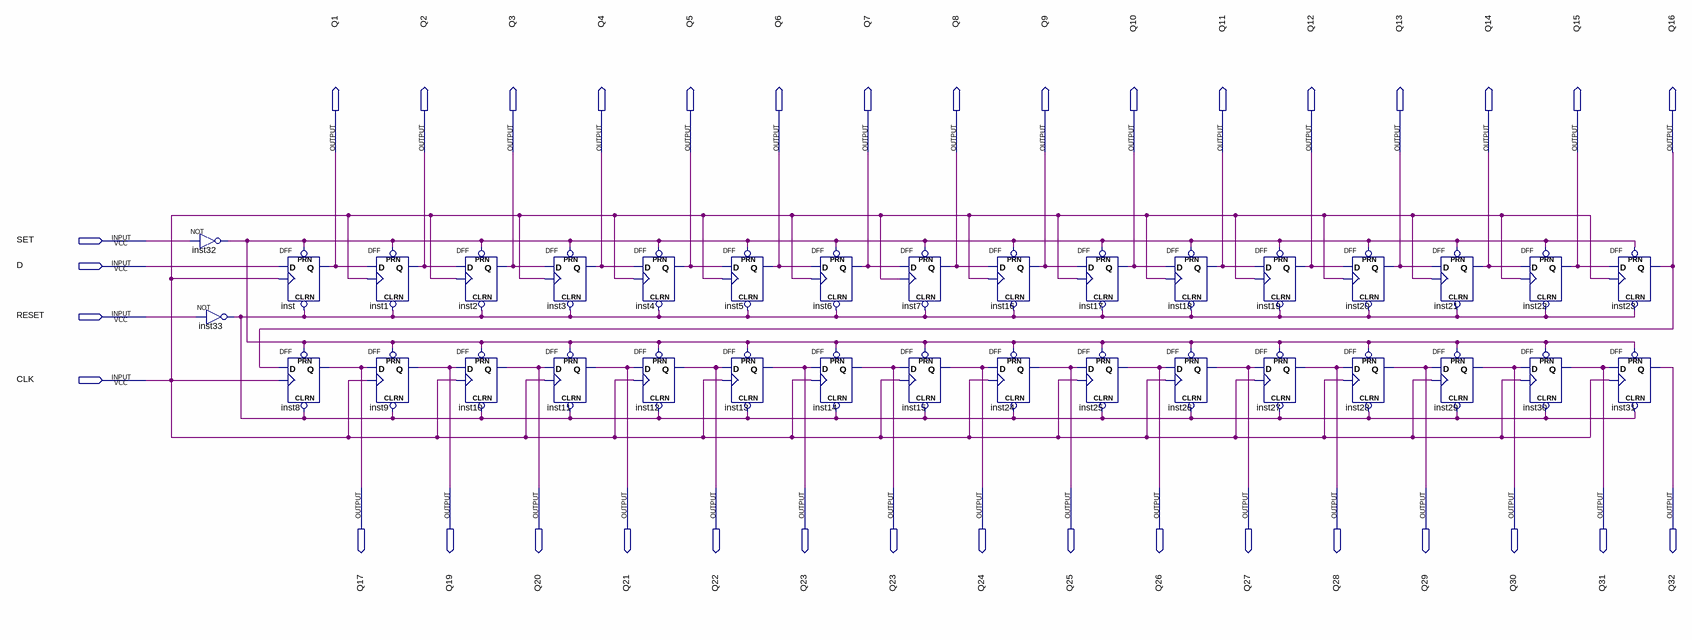
[diagram p0: schematic sheet]
// Quartus schematic registrador_32bits.bdf as structural Verilog: 34 symbols, 36 pins
module registrador_32bits (
  input  SET,
  input  D,
  input  RESET,
  input  CLK,
  output Q1,
  output Q2,
  output Q3,
  output Q4,
  output Q5,
  output Q6,
  output Q7,
  output Q8,
  output Q9,
  output Q10,
  output Q11,
  output Q12,
  output Q13,
  output Q14,
  output Q15,
  output Q16,
  output Q17,
  output Q19,
  output Q20,
  output Q21,
  output Q22,
  output Q23,
  output Q24,
  output Q25,
  output Q26,
  output Q27,
  output Q28,
  output Q29,
  output Q30,
  output Q31,
  output Q32
);

  wire inst32_out, inst33_out;

  not inst32 (inst32_out, SET);
  not inst33 (inst33_out, RESET);
  DFF inst (.CLRN(inst33_out), .CLK(CLK), .D(D), .PRN(inst32_out), .Q(Q1));
  DFF inst8 (.CLRN(inst33_out), .CLK(CLK), .D(Q16), .PRN(inst32_out), .Q(Q17));
  DFF inst1 (.CLRN(inst33_out), .CLK(CLK), .D(Q1), .PRN(inst32_out), .Q(Q2));
  DFF inst9 (.CLRN(inst33_out), .CLK(CLK), .D(Q17), .PRN(inst32_out), .Q(Q19));
  DFF inst2 (.CLRN(inst33_out), .CLK(CLK), .D(Q2), .PRN(inst32_out), .Q(Q3));
  DFF inst10 (.CLRN(inst33_out), .CLK(CLK), .D(Q19), .PRN(inst32_out), .Q(Q20));
  DFF inst3 (.CLRN(inst33_out), .CLK(CLK), .D(Q3), .PRN(inst32_out), .Q(Q4));
  DFF inst11 (.CLRN(inst33_out), .CLK(CLK), .D(Q20), .PRN(inst32_out), .Q(Q21));
  DFF inst4 (.CLRN(inst33_out), .CLK(CLK), .D(Q4), .PRN(inst32_out), .Q(Q5));
  DFF inst12 (.CLRN(inst33_out), .CLK(CLK), .D(Q21), .PRN(inst32_out), .Q(Q22));
  DFF inst5 (.CLRN(inst33_out), .CLK(CLK), .D(Q5), .PRN(inst32_out), .Q(Q6));
  DFF inst13 (.CLRN(inst33_out), .CLK(CLK), .D(Q22), .PRN(inst32_out), .Q(Q23));
  DFF inst6 (.CLRN(inst33_out), .CLK(CLK), .D(Q6), .PRN(inst32_out), .Q(Q7));
  DFF inst14 (.CLRN(inst33_out), .CLK(CLK), .D(Q23), .PRN(inst32_out), .Q(Q23));
  DFF inst7 (.CLRN(inst33_out), .CLK(CLK), .D(Q7), .PRN(inst32_out), .Q(Q8));
  DFF inst15 (.CLRN(inst33_out), .CLK(CLK), .D(Q23), .PRN(inst32_out), .Q(Q24));
  DFF inst16 (.CLRN(inst33_out), .CLK(CLK), .D(Q8), .PRN(inst32_out), .Q(Q9));
  DFF inst24 (.CLRN(inst33_out), .CLK(CLK), .D(Q24), .PRN(inst32_out), .Q(Q25));
  DFF inst17 (.CLRN(inst33_out), .CLK(CLK), .D(Q9), .PRN(inst32_out), .Q(Q10));
  DFF inst25 (.CLRN(inst33_out), .CLK(CLK), .D(Q25), .PRN(inst32_out), .Q(Q26));
  DFF inst18 (.CLRN(inst33_out), .CLK(CLK), .D(Q10), .PRN(inst32_out), .Q(Q11));
  DFF inst26 (.CLRN(inst33_out), .CLK(CLK), .D(Q26), .PRN(inst32_out), .Q(Q27));
  DFF inst19 (.CLRN(inst33_out), .CLK(CLK), .D(Q11), .PRN(inst32_out), .Q(Q12));
  DFF inst27 (.CLRN(inst33_out), .CLK(CLK), .D(Q27), .PRN(inst32_out), .Q(Q28));
  DFF inst20 (.CLRN(inst33_out), .CLK(CLK), .D(Q12), .PRN(inst32_out), .Q(Q13));
  DFF inst28 (.CLRN(inst33_out), .CLK(CLK), .D(Q28), .PRN(inst32_out), .Q(Q29));
  DFF inst21 (.CLRN(inst33_out), .CLK(CLK), .D(Q13), .PRN(inst32_out), .Q(Q14));
  DFF inst29 (.CLRN(inst33_out), .CLK(CLK), .D(Q29), .PRN(inst32_out), .Q(Q30));
  DFF inst22 (.CLRN(inst33_out), .CLK(CLK), .D(Q14), .PRN(inst32_out), .Q(Q15));
  DFF inst30 (.CLRN(inst33_out), .CLK(CLK), .D(Q30), .PRN(inst32_out), .Q(Q31));
  DFF inst23 (.CLRN(inst33_out), .CLK(CLK), .D(Q15), .PRN(inst32_out), .Q(Q16));
  DFF inst31 (.CLRN(inst33_out), .CLK(CLK), .D(Q31), .PRN(inst32_out), .Q(Q32));
endmodule
